# Altium schematic sheet Arm600.SchDoc
size A3; SheetNumber: 1; SheetTotal: 3
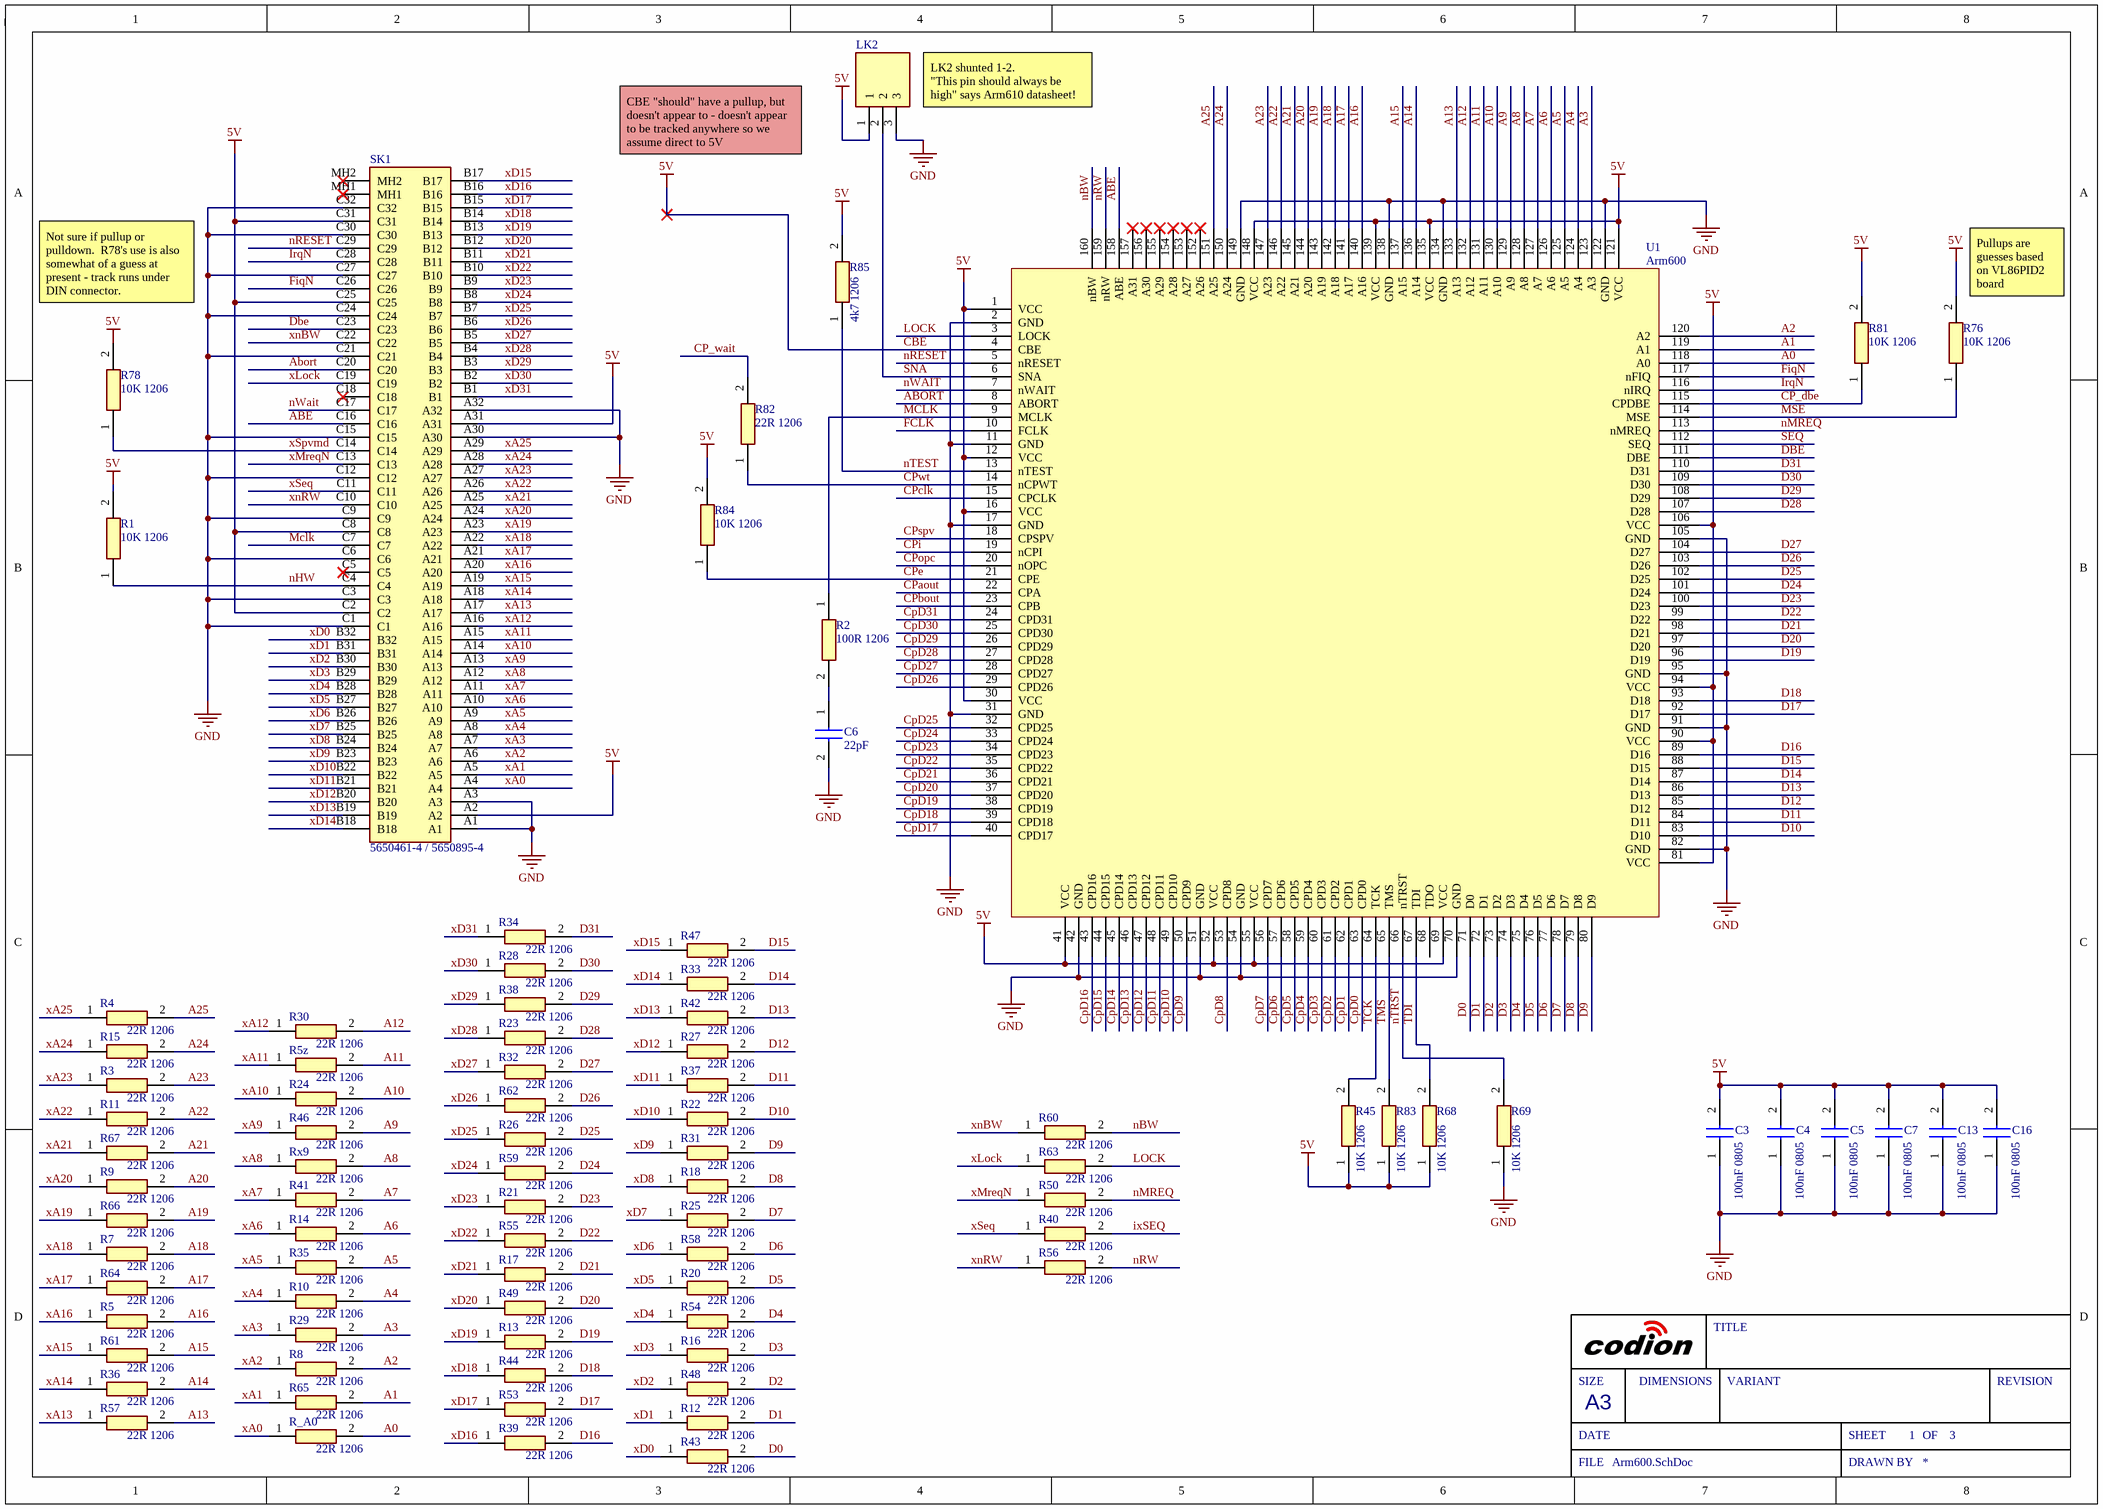
[diagram p0: Arm600.SchDoc]

## Parts
C3  100nF 0805  [CAPC2012X140N]
C4  100nF 0805  [CAPC2012X140N]
C5  100nF 0805  [CAPC2012X140N]
C6  22pF  [C0805]
C7  100nF 0805  [CAPC2012X140N]
C13  100nF 0805  [CAPC2012X140N]
C16  100nF 0805  [CAPC2012X140N]
LK2  PREC003SAAN-RC  [HDRV3W64P0X254_1X3_762X254X868P]  (value not drawn)
R1  10K 1206  [ERJUP8]
R2  100R 1206  [RESC3216X70N]
R3  22R 1206  [ERJUP8]
R4  22R 1206  [ERJUP8]
R5  22R 1206  [ERJUP8]
R5z  22R 1206  [ERJUP8]
R7  22R 1206  [ERJUP8]
R8  22R 1206  [ERJUP8]
R9  22R 1206  [ERJUP8]
R10  22R 1206  [ERJUP8]
R11  22R 1206  [ERJUP8]
R12  22R 1206  [ERJUP8]
R13  22R 1206  [ERJUP8]
R14  22R 1206  [ERJUP8]
R15  22R 1206  [ERJUP8]
R16  22R 1206  [ERJUP8]
R17  22R 1206  [ERJUP8]
R18  22R 1206  [ERJUP8]
R20  22R 1206  [ERJUP8]
R21  22R 1206  [ERJUP8]
R22  22R 1206  [ERJUP8]
R23  22R 1206  [ERJUP8]
R24  22R 1206  [ERJUP8]
R25  22R 1206  [ERJUP8]
R26  22R 1206  [ERJUP8]
R27  22R 1206  [ERJUP8]
R28  22R 1206  [ERJUP8]
R29  22R 1206  [ERJUP8]
R30  22R 1206  [ERJUP8]
R31  22R 1206  [ERJUP8]
R32  22R 1206  [ERJUP8]
R33  22R 1206  [ERJUP8]
R34  22R 1206  [ERJUP8]
R35  22R 1206  [ERJUP8]
R36  22R 1206  [ERJUP8]
R37  22R 1206  [ERJUP8]
R38  22R 1206  [ERJUP8]
R39  22R 1206  [ERJUP8]
R40  22R 1206  [ERJUP8]
R41  22R 1206  [ERJUP8]
R42  22R 1206  [ERJUP8]
R43  22R 1206  [ERJUP8]
R44  22R 1206  [ERJUP8]
R45  10K 1206  [ERJUP8]
R46  22R 1206  [ERJUP8]
R47  22R 1206  [ERJUP8]
R48  22R 1206  [ERJUP8]
R49  22R 1206  [ERJUP8]
R50  22R 1206  [ERJUP8]
R53  22R 1206  [ERJUP8]
R54  22R 1206  [ERJUP8]
R55  22R 1206  [ERJUP8]
R56  22R 1206  [ERJUP8]
R57  22R 1206  [ERJUP8]
R58  22R 1206  [ERJUP8]
R59  22R 1206  [ERJUP8]
R60  22R 1206  [ERJUP8]
R61  22R 1206  [ERJUP8]
R62  22R 1206  [ERJUP8]
R63  22R 1206  [ERJUP8]
R64  22R 1206  [ERJUP8]
R65  22R 1206  [ERJUP8]
R66  22R 1206  [ERJUP8]
R67  22R 1206  [ERJUP8]
R68  10K 1206  [ERJUP8]
R69  10K 1206  [ERJUP8]
R76  10K 1206  [ERJUP8]
R78  10K 1206  [ERJUP8]
R81  10K 1206  [ERJUP8]
R82  22R 1206  [ERJUP8]
R83  10K 1206  [ERJUP8]
R84  10K 1206  [ERJUP8]
R85  4k7 1206  [ERJ8ENF1000V]
R_A0  22R 1206  [ERJUP8]
Rx9  22R 1206  [ERJUP8]
SK1  5650461-4 / 5650895-4  [56504614]
U1  Arm600  [QFP65P3120X3120X385-160N]

## Nets
CBE: C3.2 C4.2 C5.2 C7.2 C13.2 C16.2 LK2.1 R1.2 R45.1 R68.1 R76.2 R78.2 R81.2 R83.1 R84.2 R85.2 SK1.A2 SK1.A31 SK1.C2 SK1.C8 SK1.C25 SK1.C31 U1.1(VCC) U1.4(CBE) U1.12(VCC) U1.16(VCC) U1.30(VCC) U1.41(VCC) U1.52(VCC) U1.55(VCC) U1.69(VCC) U1.81(VCC) U1.90(VCC) U1.94(VCC) U1.106(VCC) U1.121(VCC) U1.135(VCC) U1.139(VCC) U1.148(VCC)  [also labelled 5V]
GND: C3.1 C4.1 C5.1 C6.2 C7.1 C13.1 C16.1 LK2.3 R69.1 SK1.A1 SK1.A3 SK1.A30 SK1.A32 SK1.C1 SK1.C3 SK1.C6 SK1.C9 SK1.C12 SK1.C15 SK1.C21 SK1.C24 SK1.C27 SK1.C30 SK1.C32 U1.2(GND) U1.11(GND) U1.17(GND) U1.31(GND) U1.42(GND) U1.51(GND) U1.54(GND) U1.70(GND) U1.82(GND) U1.91(GND) U1.95(GND) U1.105(GND) U1.122(GND) U1.134(GND) U1.138(GND) U1.149(GND)
A0: R_A0.2 U1.118(A0)
A1: R65.2 U1.119(A1)
A2: R8.2 U1.120(A2)
A3: R29.2 U1.123(A3)
A4: R10.2 U1.124(A4)
A5: R35.2 U1.125(A5)
A6: R14.2 U1.126(A6)
A7: R41.2 U1.127(A7)
A8: Rx9.2 U1.128(A8)
A9: R46.2 U1.129(A9)
A10: R24.2 U1.130(A10)
A11: R5z.2 U1.131(A11)
A12: R30.2 U1.132(A12)
A13: R57.2 U1.133(A13)
A14: R36.2 U1.136(A14)
A15: R61.2 U1.137(A15)
A16: R5.2 U1.140(A16)
A17: R64.2 U1.141(A17)
A18: R7.2 U1.142(A18)
A19: R66.2 U1.143(A19)
A20: R9.2 U1.144(A20)
A21: R67.2 U1.145(A21)
A22: R11.2 U1.146(A22)
A23: R3.2 U1.147(A23)
A24: R15.2 U1.150(A24)
A25: R4.2 U1.151(A25)
ABE: SK1.C16 U1.158(ABE)
Abort: SK1.C20 U1.8(ABORT)
CP_dbe: R81.1 U1.115(CPDBE)
CP_wait: R82.2
CPaout: U1.22(CPA)
CPbout: U1.23(CPB)
CPclk: U1.15(CPCLK)
CpD0: U1.63(CPD0)
CpD1: U1.62(CPD1)
CpD2: U1.61(CPD2)
CpD3: U1.60(CPD3)
CpD4: U1.59(CPD4)
CpD5: U1.58(CPD5)
CpD6: U1.57(CPD6)
CpD7: U1.56(CPD7)
CpD8: U1.53(CPD8)
CpD9: U1.50(CPD9)
CpD10: U1.49(CPD10)
CpD11: U1.48(CPD11)
CpD12: U1.47(CPD12)
CpD13: U1.46(CPD13)
CpD14: U1.45(CPD14)
CpD15: U1.44(CPD15)
CpD16: U1.43(CPD16)
CpD17: U1.40(CPD17)
CpD18: U1.39(CPD18)
CpD19: U1.38(CPD19)
CpD20: U1.37(CPD20)
CpD21: U1.36(CPD21)
CpD22: U1.35(CPD22)
CpD23: U1.34(CPD23)
CpD24: U1.33(CPD24)
CpD25: U1.32(CPD25)
CpD26: U1.29(CPD26)
CpD27: U1.28(CPD27)
CpD28: U1.27(CPD28)
CpD29: U1.26(CPD29)
CpD30: U1.25(CPD30)
CpD31: U1.24(CPD31)
CPe: R84.1 U1.21(CPE)
CPi: U1.19(nCPI)
CPopc: U1.20(nOPC)
CPspv: U1.18(CPSPV)
CPwt: R82.1 U1.14(nCPWT)
D0: R43.2 U1.71(D0)
D1: R12.2 U1.72(D1)
D2: R48.2 U1.73(D2)
D3: R16.2 U1.74(D3)
D4: R54.2 U1.75(D4)
D5: R20.2 U1.76(D5)
D6: R58.2 U1.77(D6)
D7: R25.2 U1.78(D7)
D8: R18.2 U1.79(D8)
D9: R31.2 U1.80(D9)
D10: R22.2 U1.83(D10)
D11: R37.2 U1.84(D11)
D12: R27.2 U1.85(D12)
D13: R42.2 U1.86(D13)
D14: R33.2 U1.87(D14)
D15: R47.2 U1.88(D15)
D16: R39.2 U1.89(D16)
D17: R53.2 U1.92(D17)
D18: R44.2 U1.93(D18)
D19: R13.2 U1.96(D19)
D20: R49.2 U1.97(D20)
D21: R17.2 U1.98(D21)
D22: R55.2 U1.99(D22)
D23: R21.2 U1.100(D23)
D24: R59.2 U1.101(D24)
D25: R26.2 U1.102(D25)
D26: R62.2 U1.103(D26)
D27: R32.2 U1.104(D27)
D28: R23.2 U1.107(D28)
D29: R38.2 U1.108(D29)
D30: R28.2 U1.109(D30)
D31: R34.2 U1.110(D31)
Dbe: SK1.C23 U1.111(DBE)
FCLK: U1.10(FCLK)
FiqN: SK1.C26 U1.117(nFIQ)
IrqN: SK1.C28 U1.116(nIRQ)
ixSEQ: R40.2
LOCK: R63.2 U1.3(LOCK)
Mclk: R2.1 SK1.C7 U1.9(MCLK)
MSE: R76.1 U1.114(MSE)
nBW: R60.2 U1.160(nBW)
nHW: R1.1 SK1.C4
nMREQ: R50.2 U1.113(nMREQ)
nRESET: SK1.C29 U1.5(nRESET)
nRW: R56.2 U1.159(nRW)
nTEST: R85.1 U1.13(nTEST)
nTRST: R69.2 U1.66(nTRST)
nWait: SK1.C17 U1.7(nWAIT)
SEQ: U1.112(SEQ)
SNA: LK2.2 U1.6(SNA)
TCK: R45.2 U1.64(TCK)
TDI: R68.2 U1.67(TDI)
TMS: R83.2 U1.65(TMS)
xA0: R_A0.1 SK1.A4
xA1: R65.1 SK1.A5
xA2: R8.1 SK1.A6
xA3: R29.1 SK1.A7
xA4: R10.1 SK1.A8
xA5: R35.1 SK1.A9
xA6: R14.1 SK1.A10
xA7: R41.1 SK1.A11
xA8: Rx9.1 SK1.A12
xA9: R46.1 SK1.A13
xA10: R24.1 SK1.A14
xA11: R5z.1 SK1.A15
xA12: R30.1 SK1.A16
xA13: R57.1 SK1.A17
xA14: R36.1 SK1.A18
xA15: R61.1 SK1.A19
xA16: R5.1 SK1.A20
xA17: R64.1 SK1.A21
xA18: R7.1 SK1.A22
xA19: R66.1 SK1.A23
xA20: R9.1 SK1.A24
xA21: R67.1 SK1.A25
xA22: R11.1 SK1.A26
xA23: R3.1 SK1.A27
xA24: R15.1 SK1.A28
xA25: R4.1 SK1.A29
xD0: R43.1 SK1.B32
xD1: R12.1 SK1.B31
xD2: R48.1 SK1.B30
xD3: R16.1 SK1.B29
xD4: R54.1 SK1.B28
xD5: R20.1 SK1.B27
xD6: R58.1 SK1.B26
xD7: R25.1 SK1.B25
xD8: R18.1 SK1.B24
xD9: R31.1 SK1.B23
xD10: R22.1 SK1.B22
xD11: R37.1 SK1.B21
xD12: R27.1 SK1.B20
xD13: R42.1 SK1.B19
xD14: R33.1 SK1.B18
xD15: R47.1 SK1.B17
xD16: R39.1 SK1.B16
xD17: R53.1 SK1.B15
xD18: R44.1 SK1.B14
xD19: R13.1 SK1.B13
xD20: R49.1 SK1.B12
xD21: R17.1 SK1.B11
xD22: R55.1 SK1.B10
xD23: R21.1 SK1.B9
xD24: R59.1 SK1.B8
xD25: R26.1 SK1.B7
xD26: R62.1 SK1.B6
xD27: R32.1 SK1.B5
xD28: R23.1 SK1.B4
xD29: R38.1 SK1.B3
xD30: R28.1 SK1.B2
xD31: R34.1 SK1.B1
xLock: R63.1 SK1.C19
xMreqN: R50.1 SK1.C13
xnBW: R60.1 SK1.C22
xnRW: R56.1 SK1.C10
xSeq: R40.1 SK1.C11
xSpvmd: R78.1 SK1.C14
NetC6_1: C6.1 R2.2

Not connected (* = marked no-connect by the designer): SK1 C5* C18* MH1* MH2*; U1 68(TDO) 152(A26)* 153(A27)* 154(A28)* 155(A29)* 156(A30)* 157(A31)*

## Notes on the sheet
- (near LK2) LK2 shunted 1-2.
  "This pin should always be high" says Arm610 datasheet!
- CBE "should" have a pullup, but doesn't appear to - doesn't appear to be tracked anywhere so we assume direct to 5V
- Not sure if pullup or pulldown.  R78's use is also somewhat of a guess at present - track runs under DIN connector.
- (near R76) Pullups are guesses based on VL86PID2 board
- SIZE
- DIMENSIONS
- TITLE
- VARIANT
- REVISION
- DATE
- A3
- SHEET
- OF
- FILE
- DRAWN BY

## Library data of the parts
C3-C5 C7 C13 C16 = C0805C104J4JACAUTO: Capacitor; Manufacturer_Name: KEMET; Datasheet Link: https://content.kemet.com/datasheets/KEM_C1091_C0G_ESD.pdf; Height: 1.4mm; Manufacturer_Part_Number: C0805C104J4JACAUTO; Mouser Part Number: 80-C0805C104J4JAUTO; Mouser Price/Stock: https://www.mouser.co.uk/ProductDetail/KEMET/C0805C104J4JACAUTO?qs=MyNHzdoqoQKNICuQqAIXfA%3D%3D; Arrow Part Number: C0805C104J4JACAUTO; Arrow Price/Stock: https://www.arrow.com/en/products/c0805c104j4jacauto/kemet-corporation?region=nac
C6 = C0805X220K3GACTU: Capacitor; Manufacturer_Name: KEMET; Datasheet Link: https://content.kemet.com/datasheets/KEM_C1062_C0G_FT-CAP_SMD.pdf; Height: 1.1mm; Manufacturer_Part_Number: C0805X220K3GACTU
LK2 = PREC003SAAN-RC: Connector; Manufacturer_Name: Sullins; Datasheet Link: https://media.digikey.com/PDF/Data%20Sheets/Sullins%20PDFs/z%20RzCzzzSzzN-RC,%20ST,11635-B.pdf; Height: 8.68mm; Manufacturer_Part_Number: PREC003SAAN-RC
R1 R45 R68 R69 R76 R78 R81 R83 R84 = ERJ-UP8D1002V: Resistor; Manufacturer_Name: Panasonic; Datasheet Link: https://industrial.panasonic.com/cdbs/www-data/pdf/RDP0000/AOA0000C337.pdf; Height: 0.7mm; Manufacturer_Part_Number: ERJ-UP8D1002V
R2 = ERA-8AEB101V: Resistor; Manufacturer_Name: Panasonic; Datasheet Link: https://industrial.panasonic.com/cdbs/www-data/pdf/RDM0000/AOA0000C307.pdf; Height: 0.7mm; Manufacturer_Part_Number: ERA-8AEB101V; Mouser Part Number: 667-ERA-8AEB101V; Mouser Price/Stock: https://www.mouser.co.uk/ProductDetail/Panasonic/ERA-8AEB101V?qs=Ojoo2rCVP9RpW8HgSjFLGA%3D%3D; Arrow Part Number: ERA-8AEB101V; Arrow Price/Stock: https://www.arrow.com/en/products/era8aeb101v/panasonic?region=europe
R3-R5 R5z R7-R18 R20-R44 R46-R50 R53-R67 R82 R_A0 Rx9 = ERJ-UP8D22R0V: Resistor; Manufacturer_Name: Panasonic; Datasheet Link: https://industrial.panasonic.com/cdbs/www-data/pdf/RDP0000/AOA0000C337.pdf; Height: 0.7mm; Manufacturer_Part_Number: ERJ-UP8D22R0V
R85 = ERJ-8ENF4701V: Resistor; Manufacturer_Name: Panasonic; Datasheet Link: https://industrial.panasonic.com/cdbs/www-data/pdf/RDA0000/AOA0000C86.pdf; Height: 0.7mm; Manufacturer_Part_Number: ERJ-8ENF4701V; Mouser Part Number: 667-ERJ-8ENF4701V; Mouser Price/Stock: https://www.mouser.co.uk/ProductDetail/Panasonic/ERJ-8ENF4701V?qs=8%252BG0TiN%2FgVpQwzrqnqT%252BJA%3D%3D; Arrow Part Number: ERJ-8ENF4701V; Arrow Price/Stock: https://www.arrow.com/en/products/erj-8enf4701v/panasonic
SK1 = 5650461-4: Connector; Manufacturer_Name: TE Connectivity; Datasheet Link: https://componentsearchengine.com/Datasheets/2/5650461-4.pdf; Height: 10.49mm; Manufacturer_Part_Number: 5650461-4; Mouser Part Number: 571-5650461-4; Mouser Price/Stock: https://www.mouser.co.uk/ProductDetail/TE-Connectivity/5650461-4?qs=xrnNvQC1SKQ%2FjdFwmiH0Uw%3D%3D; Arrow Part Number: 5650461-4; Arrow Price/Stock: https://www.arrow.com/en/products/5650461-4/te-connectivity
U1 = Arm600: Arm600 - VY06192 / VY86C600